# Altium project PE2.PrjPcb
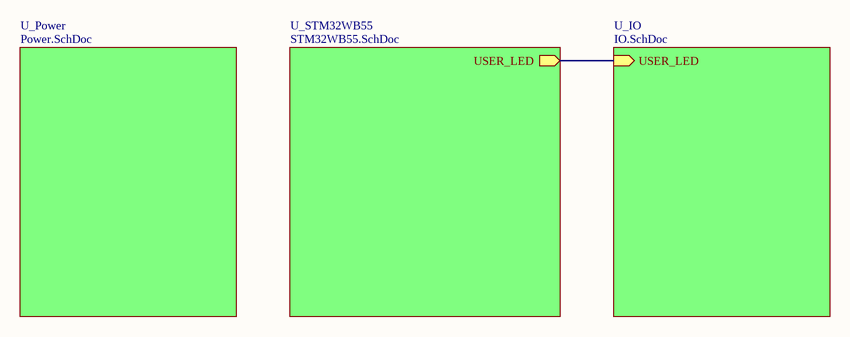
[diagram p0: TOP.SchDoc]
4 sheets, 98 parts. Net scope: hierarchical (ports join the sheet entries above them; power ports are global).
Board files: PCB.PcbDoc, PCB_Panel.PcbDoc, HalfPCB1.PcbDoc, HalfPCB2.PcbDoc
Sheets:
  TOP.SchDoc
    U_IO = IO.SchDoc
    U_Power = Power.SchDoc
    U_STM32WB55 = STM32WB55.SchDoc

## Sheet TOP.SchDoc: HB+SPO2 | Top
size A4; DocumentNumber: 1; Revision: 1b; SheetNumber: 1; SheetTotal: 4

### Sub-sheets
U_IO = IO.SchDoc: USER_LED (in)
U_Power = Power.SchDoc: no entries
U_STM32WB55 = STM32WB55.SchDoc: USER_LED (out)

### Nets
NetD4_1: sheet U_IO/USER_LED, sheet U_STM32WB55/USER_LED

### Notes on the sheet
- Title
- Size:
- Date:
- A4
- Number:
- Time:
- Revision:
- Sheet
- of
- ShareFox
- File:

## Sheet IO.SchDoc: HB+SPO2 | IO
size A4; DocumentNumber: 4; Revision: 2; SheetNumber: 4; SheetTotal: 4
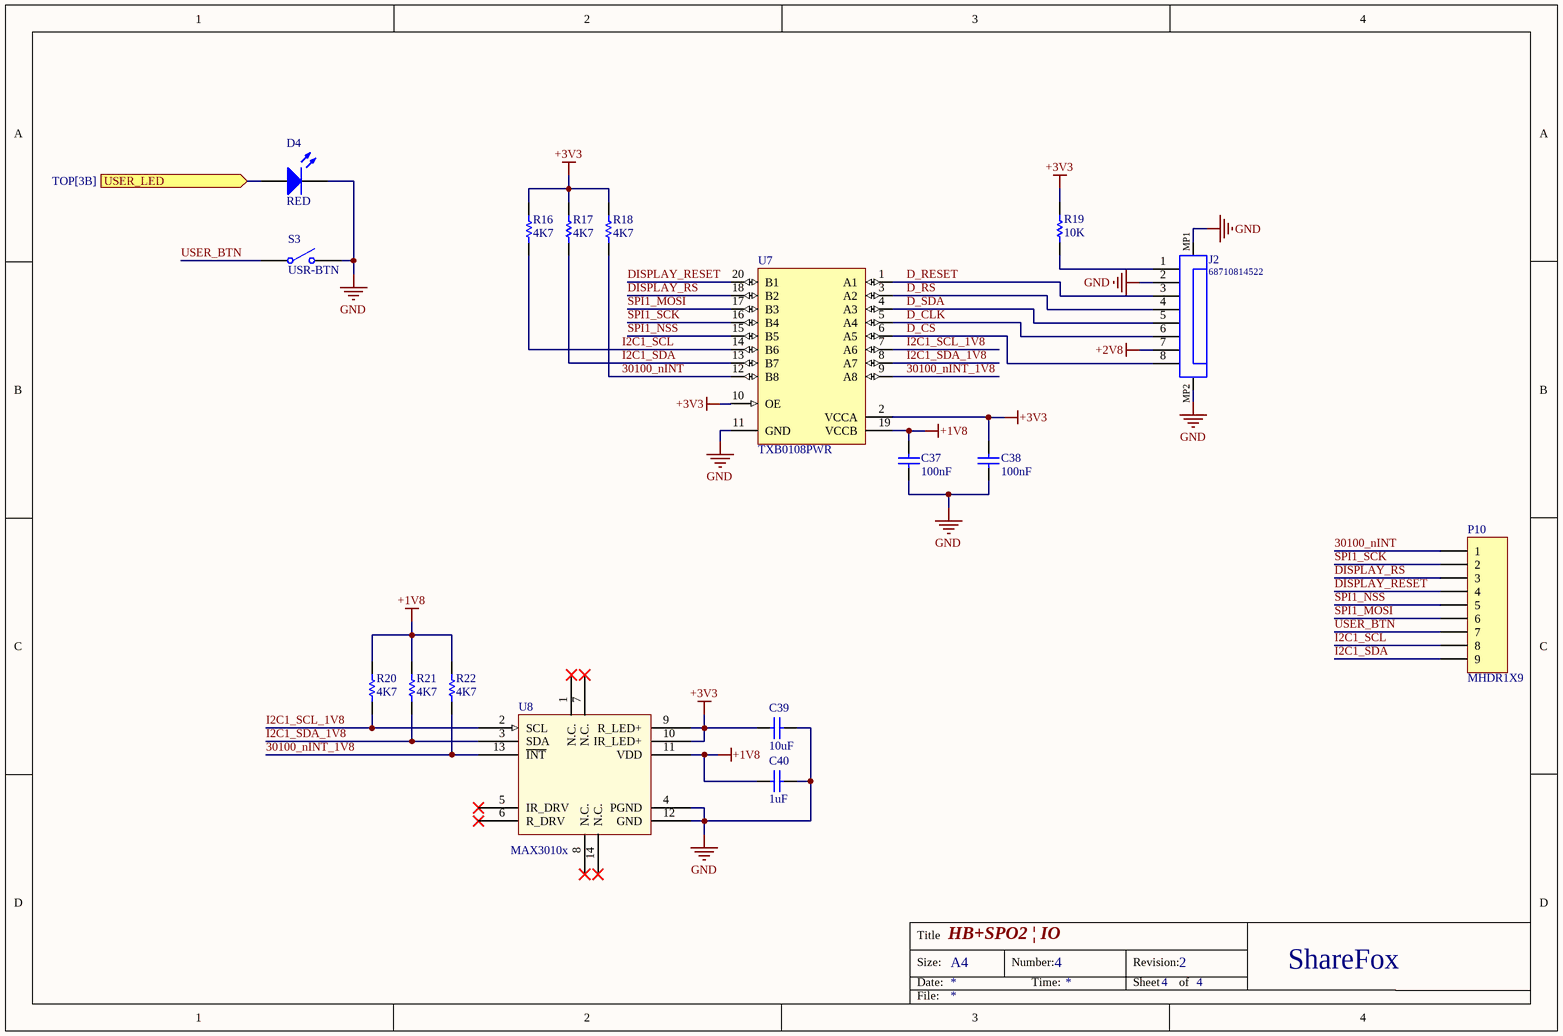
[diagram p1: IO.SchDoc]

### Parts
C37  100nF  [C_0603]
C38  100nF  [C_0603]
C39  10uF  [C_0805]
C40  1uF  [C_0603]
D4  RED  [D-0603]
J2  68710814522  [68710814522]
P10  MHDR1X9  [MHDR1X9]
R16  4K7  [C_0603]
R17  4K7  [C_0603]
R18  4K7  [C_0603]
R19  10K  [C_0603]
R20  4K7  [C_0603]
R21  4K7  [C_0603]
R22  4K7  [C_0603]
S3  USR-BTN  [HDR1X2]
U7  TXB0108PWR  [PW0020A_L]
U8  MAX3010x  [OESIP14R560x330]

### Ports
USER_LED (in, see TOP[3B])

### Nets
+1V8: C37.2 C40.2 R20.2 R21.2 R22.2 U7.19(VCCB) U8.11(VDD)
+2V8: J2.7
+3V3: C38.2 C39.2 R16.2 R17.2 R18.2 R19.1 U7.2(VCCA) U7.10(OE) U8.9(R_LED+) U8.10(IR_LED+)
GND: C37.1 C38.1 C39.1 C40.1 D4.2(K) J2.2 J2.MP1 J2.MP2 S3.2(NO) U7.11(GND) U8.4(PGND) U8.12(GND)
30100_nINT: P10.1 R18.1 U7.12(B8)
30100_nINT_1V8: R22.1 U7.9(A8) U8.13(~{INT})
D_CLK: J2.6 U7.5(A4)
D_CS: J2.8 U7.6(A5)
D_RESET: J2.3 U7.1(A1)
D_RS: J2.4 U7.3(A2)
D_SDA: J2.5 U7.4(A3)
DISPLAY_RESET: P10.4 U7.20(B1)
DISPLAY_RS: P10.3 U7.18(B2)
I2C1_SCL: P10.8 R16.1 U7.14(B6)
I2C1_SCL_1V8: R20.1 U7.7(A6) U8.2(SCL)
I2C1_SDA: P10.9 R17.1 U7.13(B7)
I2C1_SDA_1V8: R21.1 U7.8(A7) U8.3(SDA)
SPI1_MOSI: P10.6 U7.17(B3)
SPI1_NSS: P10.5 U7.15(B5)
SPI1_SCK: P10.2 U7.16(B4)
USER_BTN: P10.7 S3.1(COMMON)
NetD4_1: D4.1(A) ; port USER_LED
NetJ2_1: J2.1 R19.2

Not connected (* = marked no-connect by the designer): U8 1(N.C.)* 5(IR_DRV)* 6(R_DRV)* 7(N.C.)* 8(N.C.)* 14(N.C.)*

### Notes on the sheet
- Title
- Size:
- Date:
- A4
- Number:
- Time:
- Revision:
- Sheet
- of
- ShareFox
- File:

### Library data of the parts
C37-C40 = Cap: Capacitor; Published: 8-Jun-2000; LatestRevisionDate: 17-Jul-2002; LatestRevisionNote: Re-released for DXP Platform.; PackageReference: RAD-0.3; Publisher: Altium Limited; PackageDescription: Radial Cap, Thru-Hole; 2 Leads; 0.3 in Pin Spacing
  C37 C38: Value: 100nF
  C39: Value: 10uF
  C40: Value: 1uF
D4 = LED2: Typical RED, GREEN, YELLOW, AMBER GaAs LED; Published: 8-Jun-2000; LatestRevisionDate: 17-Jul-2002; LatestRevisionNote: Re-released for DXP Platform.; PackageVersion: Feb-2002; PackageReference: 3.2X1.6X1.1; Publisher: Altium Limited; PackageDescription: SM LED; 2 Flat Leads
J2 = CMP-1502-01528-1: SMT ZIF Connectors WR-FPC, Horizontal, Bottom Contact, pitch 0.5 mm, 8 pins; Manufacturer: Wurth Elektronik; Contact Resistance: 20mOhm; Pitch: 0.5mm; Withstanding Voltage: 250VAC; Working Voltage: 50VAC; Pin Number: 8; Rated Current: 0.5A; Contact Design: BottomContact; Publisher: WurthElektronik; Orientation: Horizontal; Manufacturer URL: http://www.we-online.de; Part Number: 68710814522; Mounting Technology: SMT; Packaging: TapeandReel; Package Reference: 68710814522; Operating Temperature: -25to85degC; Datasheet URL: https://katalog.we-online.de/em/datasheet/68710814522.pdf
P10 = MHDR1X9: Header, 9-Pin; LatestRevisionDate: 17-Jul-2002; LatestRevisionNote: Re-released for DXP Platform.; Publisher: Altium Limited
R16-R22 = Res1: Resistor; Published: 8-Jun-2000; LatestRevisionDate: 17-Jul-2002; LatestRevisionNote: Re-released for DXP Platform.; PackageReference: AXIAL-0.3; Publisher: Altium Limited; PackageDescription: Axial Device, Thru-Hole; 2 Leads; 0.3 in Pin Spacing
  R16-R18 R20-R22: Value: 4K7
  R19: Value: 10K
S3 = SW-SPST: Single-Pole, Single-Throw Switch; Published: 24-Mar-1999; LatestRevisionDate: 17-Jul-2002; LatestRevisionNote: Re-released for DXP Platform.; PackageReference: SPST-2; Publisher: Altium Limited; PackageDescription: Switch; 2 Leads
U7 = CMP-2000-07337-1: TXB0108 8-Bit Bidirectional Voltage-Level Translator with Auto-Direction Sensing and / +/- 15-kV ESD Protection, 1.2 to 3.6 V, -40 to 85 degC, 20-Pin TSSOP (PW), Green (RoHS & no Sb/Br), Tape and Reel; Manufacturer: Texas Instruments; Propagation Delay (Max): 4ns; Logic Function: Translator,Bidirectional; Input Type: Logic; Package Version: 4040064-5/G, 02/2011; Voltage - Supply: 1.2V~3.6V,1.65V~5.5V; Data Rate: 100Mbps; Other Names: 296-21527-6; Number of Channels: 8; Differential - Input: Output:No/No; Number of Outputs/Channel: 1; Product Training Modules: VoltageLevelTranslation; Dynamic Catalog: TXBSeries; Package Reference: PW20; Package Description: 20-Pin Small Outline Package Integrated Circuit, Body 6.5 x 4.4 mm, Pitch 0.65 mm; Category: IntegratedCircuits(ICs); Datasheet URL: http://www.ti.com/general/docs/lit/getliterature.tsp?genericPartNumber=TXB0108&fileType=pdf; Package / Case: 20-TSSOP(0.173",4.40mmWidth); Family: Logic-Translators; Standard Package: 1; Series: -; Manufacturer URL: http://www.ti.com/; Number of Bits: 8; Package URL: http://www.ti.com/litv/pdf/mpds362; Output Type: Logic; Datasheet Version: Rev. F, 12/2014; Packaging: Digi-Reel®; Operating Temperature: -40°C~85°C; Supplier Device Package: 20-TSSOP; Mounting Technology: SurfaceMount
U8 = MAX3010x: Pulse Oximeter and Heart-Rate Sensor IC  for Wearable Health

## Sheet Power.SchDoc: HB+SPO2 | Power
size A4; DocumentNumber: 2; Revision: 2; SheetNumber: 2; SheetTotal: 4
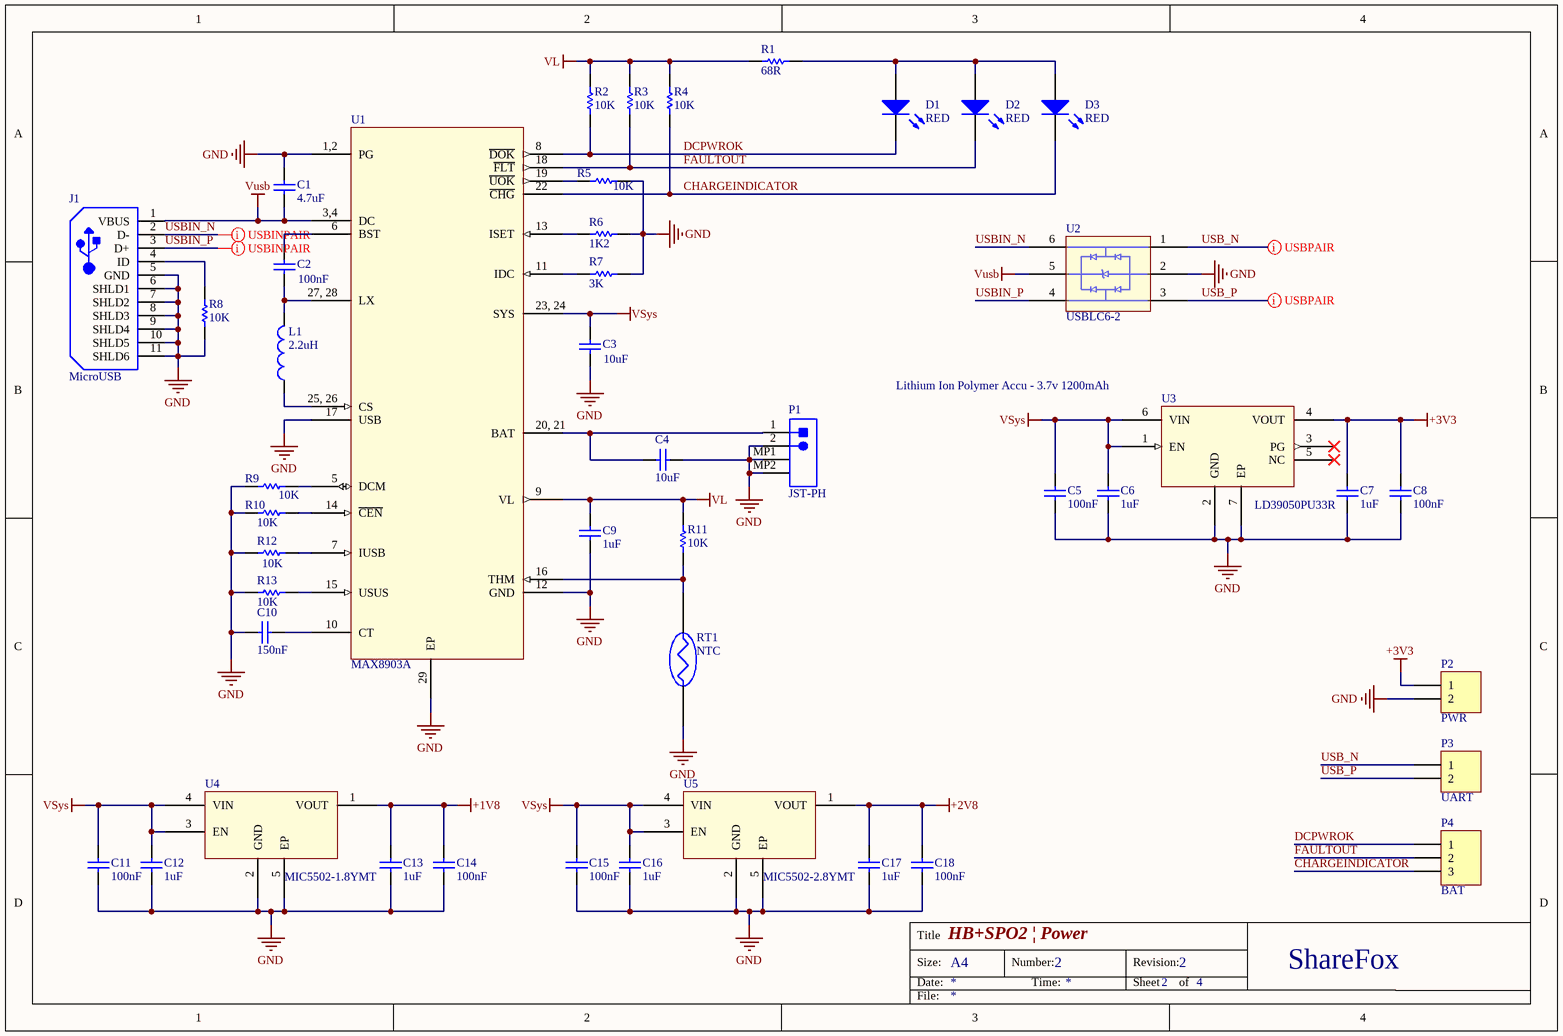
[diagram p2: Power.SchDoc]

### Parts
C1  4.7uF  [C_1206]
C2  100nF  [C_0603]
C3  10uF  [C_0805]
C4  10uF  [C_0805]
C5  100nF  [C_0603]
C6  1uF  [C_0603]
C7  1uF  [C_0603]
C8  100nF  [C_0603]
C9  1uF  [C_0603]
C10  150nF  [C_0603]
C11  100nF  [C_0603]
C12  1uF  [C_0603]
C13  1uF  [C_0603]
C14  100nF  [C_0603]
C15  100nF  [C_0603]
C16  1uF  [C_0603]
C17  1uF  [C_0603]
C18  100nF  [C_0603]
D1  RED  [D-0603]
D2  RED  [D-0603]
D3  RED  [D-0603]
J1  MicroUSB  [FCI-10118194-0001LF-5_V]
L1  2.2uH  [L-1008]
P1  JST-PH  [JST- S2B-PH-SM4-TB(LF)(SN)-2_V]
P2  PWR  [MHDR1X2]
P3  UART  [MHDR1X2]
P4  BAT  [MHDR1X3]
R1  68R  [C_0603]
R2  10K  [C_0603]
R3  10K  [C_0603]
R4  10K  [C_0603]
R5  10K  [C_0603]
R6  1K2  [C_0603]
R7  3K  [C_0603]
R8  10K  [C_0603]
R9  10K  [C_0603]
R10  10K  [C_0603]
R11  10K  [C_0603]
R12  10K  [C_0603]
R13  10K  [C_0603]
RT1  NTC  [HDR1X2]
U1  MAX8903A  [QFN28P40S400X400EP260x260]
U2  USBLC6-2  [SOT23-6P95R280X90]
U3  LD39050PU33R  [SON6P95S300X300EP237x149]
U4  MIC5502-1.8YMT  [DFN4P65S100x100EP48x48]
U5  MIC5502-2.8YMT  [DFN4P65S100x100EP48x48]

### Nets
+1V8: C13.1 C14.1 U4.1(VOUT)
+2V8: C17.1 C18.1 U5.1(VOUT)
+3V3: C7.1 C8.1 P2.1 U3.4(VOUT)
GND: C1.1 C3.1 C4.1 C5.2 C6.2 C7.2 C8.2 C9.2 C10.1 C11.2 C12.2 C13.2 C14.2 C15.2 C16.2 C17.2 C18.2 J1.5(GND) J1.6(SHLD1) J1.7(SHLD2) J1.8(SHLD3) J1.9(SHLD4) J1.10(SHLD5) J1.11(SHLD6) P1.2 P1.MP1 P1.MP2 P2.2 R5.1 R6.1 R7.1 R8.2 R9.2 R10.2 R12.2 R13.2 RT1.1 U1.1,2(PG) U1.12(GND) U1.17(USB) U1.29(EP) U2.2 U3.2(GND) U3.7(EP) U4.2(GND) U4.5(EP) U5.2(GND) U5.5(EP)
VL: C9.1 R1.2 R2.2 R3.2 R4.2 R11.1 U1.9(VL)
VSys: C3.2 C5.1 C6.1 C11.1 C12.1 C15.1 C16.1 U1.23,_24(SYS) U3.1(EN) U3.6(VIN) U4.3(EN) U4.4(VIN) U5.3(EN) U5.4(VIN)
Vusb: C1.2 J1.1(VBUS) U1.3,4(DC) U2.5
CHARGEINDICATOR: D3.2(K) P4.3 R4.1 U1.22(~{CHG})
DCPWROK: D1.2(K) P4.1 R2.1 U1.8(~{DOK})
FAULTOUT: D2.2(K) P4.2 R3.1 U1.18(~{FLT})
USB_N: P3.1 U2.1
USB_P: P3.2 U2.3
USBIN_N: J1.2(D-) U2.6
USBIN_P: J1.3(D+) U2.4
NetC2_1: C2.1 L1.2 U1.27,_28(LX)
NetC2_2: C2.2 U1.6(BST)
NetC4_2: C4.2 P1.1 U1.20,_21(BAT)
NetC10_2: C10.2 U1.10(CT)
NetD1_1: D1.1(A) D2.1(A) D3.1(A) R1.1
NetJ1_4: J1.4(ID) R8.1
NetL1_1: L1.1 U1.25,_26(CS)
NetR5_2: R5.2 U1.19(~{UOK})
NetR6_2: R6.2 U1.13(ISET)
NetR7_2: R7.2 U1.11(IDC)
NetR9_1: R9.1 U1.5(DCM)
NetR10_1: R10.1 U1.14(~{CEN})
NetR11_2: R11.2 RT1.2 U1.16(THM)
NetR12_1: R12.1 U1.7(IUSB)
NetR13_1: R13.1 U1.15(USUS)

Not connected (* = marked no-connect by the designer): U3 3(PG)* 5(NC)*

### Layout directives
differential pair: USB_N, USB_P, USBIN_N, USBIN_P

### Notes on the sheet
- (near P1) Lithium Ion Polymer Accu - 3.7v 1200mAh
- Title
- Size:
- Date:
- A4
- Number:
- Time:
- Revision:
- Sheet
- of
- ShareFox
- File:

### Library data of the parts
C1-C18 = Cap: Capacitor; Published: 8-Jun-2000; LatestRevisionDate: 17-Jul-2002; LatestRevisionNote: Re-released for DXP Platform.; PackageReference: RAD-0.3; Publisher: Altium Limited; PackageDescription: Radial Cap, Thru-Hole; 2 Leads; 0.3 in Pin Spacing
  C1: Value: 4.7uF
  C2 C5 C8 C11 C14 C15 C18: Value: 100nF
  C3 C4: Value: 10uF
  C6 C7 C9 C12 C13 C16 C17: Value: 1uF
  C10: Value: 150nF
D1-D3 = LED2: as D4 on sheet IO; Published: 8-Jun-2000; LatestRevisionDate: 17-Jul-2002; LatestRevisionNote: Re-released for DXP Platform.; PackageVersion: Feb-2002; PackageReference: 3.2X1.6X1.1; Publisher: Altium Limited; PackageDescription: SM LED; 2 Flat Leads
J1 = CMP-2000-05120-1: Micro USB B Type Receptacle, 1.8 A, -55 to 85 degC, 5-Pin SMD, RoHS, Tape and Reel; Manufacturer: Amphenol FCI; Body Orientation: RightAngle; Number of Contacts: 5; Pitch: 0.65mm; Gender: RCP; Rad Hard: No; Package Reference: 10118194-0001LF-5; Mounting: SurfaceMount; Manufacturer URL: http://www.fci.com/; Packaging: CutTape; Datasheet URL: https://datasheet.ciiva.com/26945/getdatasheetpartid-418619-26945695.pdf; Termination Method: Solder; Package Description: 5-Pin Surface Mount Device, Body 8.05 x 5.53 mm, Pitch 0.65 mm; Type: MicroUSBTypeB; Datasheet Version: Rev. A, 10/2011
L1 = Inductor: Code_IEC: 1005; Published: 8-Jun-2000; LatestRevisionDate: 29-May-2009; LatestRevisionNote: IPC-7351 Footprint Added.; PackageReference: 0402-A; Publisher: Altium Limited; PackageDescription: Chip Inductor; Code_JEITA: 0402; Value: 2.2uH
P1 = CMP-1755-00001-1: Male Header, Pitch 2 mm, 1 x 2 Position, Height 5.5 mm, -25 to 85 degC, RoHS, Tape and Reel; Current Rating: 3 A; ComponentLink1URL: http://www.jst.com/home2.html; Radiation Hardening: No; RoHSCompliant: True; Mount: Through Hole; Contact Material: Bronze; Package Quantity: 100; Width: 2.34 mm; DatasheetVersion: Dec-12; Height: 8.13 mm; Max Operating Temperature: 105degC; ComponentLink2Description: Datasheet; Lead Pitch: 0.1 inch; Contact Finish: Lead; Packaging: Bulk; Colour: Black; Contact Plating: Tin; Min Operating Temperature: -65degC; ComponentLink1Description: Manufacturer URL; PackageReference: S2B-PH-SM4-TB(LF)(SN)-2; PackageDescription: Male Header, Pitch 2 mm, 1 x 2 Position, Height 5.5 mm; ComponentLink2URL: http://www.jst-mfg.com/product/pdf/eng/ePH.pdf; Pins: 40; Length: 101.19 mm
P2 P3 = MHDR1X2: Header, 2-Pin; LatestRevisionDate: 17-Jul-2002; LatestRevisionNote: Re-released for DXP Platform.; Publisher: Altium Limited
P4 = MHDR1X3: Header, 3-Pin; LatestRevisionDate: 17-Jul-2002; LatestRevisionNote: Re-released for DXP Platform.; Publisher: Altium Limited
R1-R13 = Res1: Resistor; Published: 8-Jun-2000; LatestRevisionDate: 17-Jul-2002; LatestRevisionNote: Re-released for DXP Platform.; PackageReference: AXIAL-0.3; Publisher: Altium Limited; PackageDescription: Axial Device, Thru-Hole; 2 Leads; 0.3 in Pin Spacing
  R1: Value: 68R
  R2-R5 R8-R13: Value: 10K
  R6: Value: 1K2
  R7: Value: 3K
RT1 = NTC/PTC: 2322-640-63103
U1 = MAX8903A: 2A 1-Cell Li+ DC-DC Chargersfor USB and Adapter Power
U2 = USBLC6-2: Very low capacitance ESD protection
U3 = LD39050PUxxR: 500 mA low quiescent current and low noise voltage regulator
U4 U5 = MIC550x-x.xYMT: Single 300mA LDO

## Sheet STM32WB55.SchDoc: HB+SPO2 | STM
size A4; DocumentNumber: 3; Revision: 2; SheetNumber: 3; SheetTotal: 4
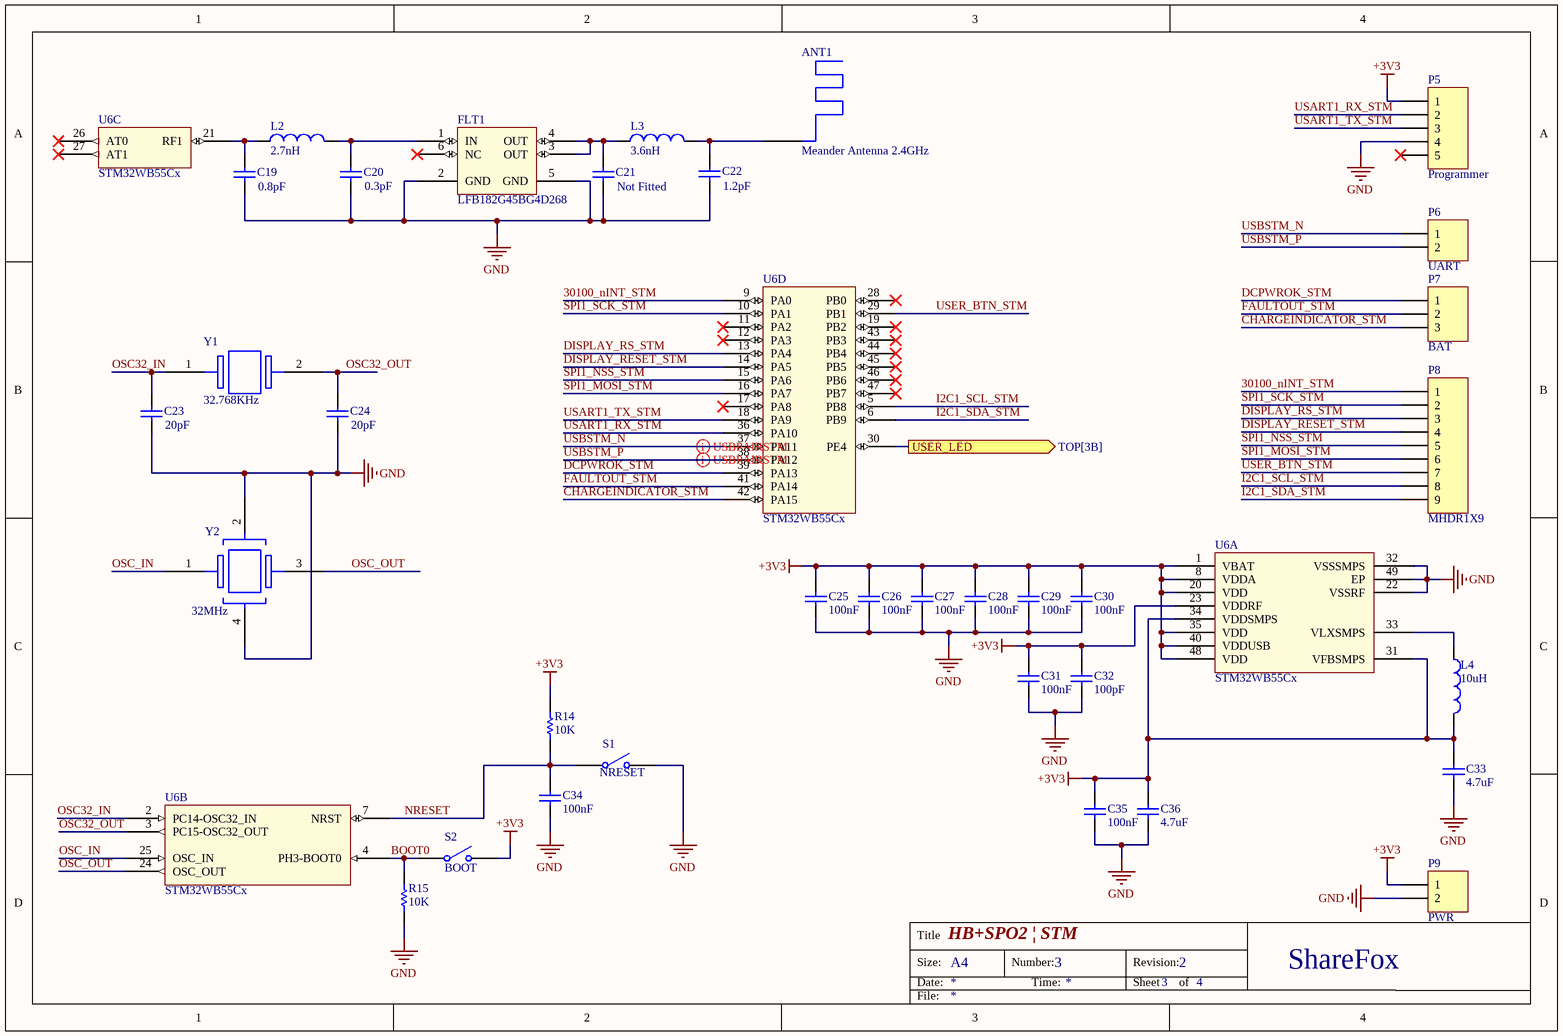
[diagram p3: STM32WB55.SchDoc]

### Parts
ANT1  Meander Antenna 2.4GHz  [Meander2.4G]
C19  0.8pF  [C_0603]
C20  0.3pF  [C_0603]
C21  Not Fitted  [C_0603]
C22  1.2pF  [C_0603]
C23  20pF  [C_0603]
C24  20pF  [C_0603]
C25  100nF  [C_0603]
C26  100nF  [C_0603]
C27  100nF  [C_0603]
C28  100nF  [C_0603]
C29  100nF  [C_0603]
C30  100nF  [C_0603]
C31  100nF  [C_0603]
C32  100pF  [C_0603]
C33  4.7uF  [C_1206]
C34  100nF  [C_0603]
C35  100nF  [C_0603]
C36  4.7uF  [C_1206]
FLT1  LFB182G45BG4D268  [LFB182G45BG4D268]
L2  2.7nH  [L-0603]
L3  3.6nH  [L-0603]
L4  10uH  [L-0603]
P5  Programmer  [HDR1X5]
P6  UART  [MHDR1X2]
P7  BAT  [MHDR1X3]
P8  MHDR1X9  [MHDR1X9]
P9  PWR  [MHDR1X2]
R14  10K  [C_0603]
R15  10K  [C_0603]
S1  NRESET  [B3U-1000P-B]
S2  BOOT  [B3U-1000P-B]
U6  STM32WB55Cx  [QFN48P50S700x700EP560x560]  (parts A,B,C,D of 4)
Y1  32.768KHz  [ECX-31B]
Y2  32MHz  [Y_3225]

### Ports
USER_LED (out, see TOP[3B])

### Nets
+3V3: C25.2 C26.2 C27.2 C28.2 C29.2 C30.2 C31.2 C32.2 C33.2 C35.2 C36.2 L4.2 P5.1 P9.1 R14.1 S2.2(NO) U6.1(VBAT) U6.8(VDDA) U6.20(VDD) U6.23(VDDRF) U6.31(VFBSMPS) U6.34(VDDSMPS) U6.35(VDD) U6.40(VDDUSB) U6.48(VDD)
GND: C19.1 C20.1 C21.1 C22.1 C23.1 C24.1 C25.1 C26.1 C27.1 C28.1 C29.1 C30.1 C31.1 C32.1 C33.1 C34.2 C35.1 C36.1 FLT1.2(GND) FLT1.5(GND) P5.4 P9.2 R15.1 S1.2(NO) U6.22(VSSRF) U6.32(VSSSMPS) U6.49(EP) Y2.2 Y2.4
30100_nINT_STM: P8.1 U6.9(PA0)
BOOT0: R15.2 S2.1(COMMON) U6.4(PH3-BOOT0)
CHARGEINDICATOR_STM: P7.3 U6.42(PA15)
DCPWROK_STM: P7.1 U6.39(PA13)
DISPLAY_RESET_STM: P8.4 U6.14(PA5)
DISPLAY_RS_STM: P8.3 U6.13(PA4)
FAULTOUT_STM: P7.2 U6.41(PA14)
I2C1_SCL_STM: P8.8 U6.5(PB8)
I2C1_SDA_STM: P8.9 U6.6(PB9)
NRESET: C34.1 R14.2 S1.1(COMMON) U6.7(NRST)
OSC32_IN: C23.2 U6.2(PC14-OSC32_IN) Y1.1
OSC32_OUT: C24.2 U6.3(PC15-OSC32_OUT) Y1.2
OSC_IN: U6.25(OSC_IN) Y2.1
OSC_OUT: U6.24(OSC_OUT) Y2.3
SPI1_MOSI_STM: P8.6 U6.16(PA7)
SPI1_NSS_STM: P8.5 U6.15(PA6)
SPI1_SCK_STM: P8.2 U6.10(PA1)
USART1_RX_STM: P5.2 U6.36(PA10)
USART1_TX_STM: P5.3 U6.18(PA9)
USBSTM_N: P6.1 U6.37(PA11)
USBSTM_P: P6.2 U6.38(PA12)
USER_BTN_STM: P8.7 U6.29(PB1)
NetANT1_1: ANT1.1 C22.2 L3.2
NetC19_2: C19.2 L2.1 U6.21(RF1)
NetC20_2: C20.2 FLT1.1(IN) L2.2
NetC21_2: C21.2 FLT1.3(OUT) FLT1.4(OUT) L3.1
NetD4_1: U6.30(PE4) ; port USER_LED
NetL4_1: L4.1 U6.33(VLXSMPS)

Not connected (* = marked no-connect by the designer): FLT1 6(NC)*; P5 5*; U6 11(PA2)* 12(PA3)* 17(PA8)* 19(PB2)* 26(AT0)* 27(AT1)* 28(PB0)* 43(PB3)* 44(PB4)* 45(PB5)* 46(PB6)* 47(PB7)*

### Layout directives
differential pair: USBSTM_N, USBSTM_P

### Notes on the sheet
- Title
- Size:
- Date:
- A4
- Number:
- Time:
- Revision:
- Sheet
- of
- ShareFox
- File:

### Library data of the parts
ANT1 = Meander Antenna 2.4GHz: PCB TRACE / DONT TRY TO LOOK FOR PARTS
C19-C36 = Cap: Capacitor; Published: 8-Jun-2000; LatestRevisionDate: 17-Jul-2002; LatestRevisionNote: Re-released for DXP Platform.; PackageReference: RAD-0.3; Publisher: Altium Limited; PackageDescription: Radial Cap, Thru-Hole; 2 Leads; 0.3 in Pin Spacing
  C19: Value: 0.8pF
  C20: Value: 0.3pF
  C21: Value: Not Fitted
  C22: Value: 1.2pF
  C23 C24: Value: 20pF
  C25-C31 C34 C35: Value: 100nF
  C32: Value: 100pF
  C33 C36: Value: 4.7uF
FLT1 = LFB182G45BG4D268: Ultra-small, low-profiled, lightweight band-pass filters.
L2-L4 = Inductor: Code_IEC: 1005; Published: 8-Jun-2000; LatestRevisionDate: 29-May-2009; LatestRevisionNote: IPC-7351 Footprint Added.; PackageReference: 0402-A; Publisher: Altium Limited; PackageDescription: Chip Inductor; Code_JEITA: 0402
  L2: Value: 2.7nH
  L3: Value: 3.6nH
  L4: Value: 10uH
P5 = MHDR1X5: Header, 5-Pin; LatestRevisionDate: 17-Jul-2002; LatestRevisionNote: Re-released for DXP Platform.; Publisher: Altium Limited
P6 P9 = MHDR1X2: Header, 2-Pin; LatestRevisionDate: 17-Jul-2002; LatestRevisionNote: Re-released for DXP Platform.; Publisher: Altium Limited
P7 = MHDR1X3: Header, 3-Pin; LatestRevisionDate: 17-Jul-2002; LatestRevisionNote: Re-released for DXP Platform.; Publisher: Altium Limited
P8 = MHDR1X9: Header, 9-Pin; LatestRevisionDate: 17-Jul-2002; LatestRevisionNote: Re-released for DXP Platform.; Publisher: Altium Limited
R14 R15 = Res1: Resistor; Published: 8-Jun-2000; LatestRevisionDate: 17-Jul-2002; LatestRevisionNote: Re-released for DXP Platform.; PackageReference: AXIAL-0.3; Publisher: Altium Limited; PackageDescription: Axial Device, Thru-Hole; 2 Leads; 0.3 in Pin Spacing; Value: 10K
S1 S2 = SW-SPST: Single-Pole, Single-Throw Switch; Published: 24-Mar-1999; LatestRevisionDate: 17-Jul-2002; LatestRevisionNote: Re-released for DXP Platform.; PackageReference: SPST-2; Publisher: Altium Limited; PackageDescription: Switch; 2 Leads
U6 = STM32WB55Cx: Multiprotocol wireless 32-bit MCU Arm®-based Cortex®-M4 with FPU, Bluetooth® 5 and 802.15.4 radio solution
Y1 = XTAL 3215
Y2 = XTAL 3225 2_4GND

## Nets that join several sheets
+1V8: IO (7 pins), Power (C13.1 C14.1 U4.1)
+2V8: IO (J2.7), Power (C17.1 C18.1 U5.1)
+3V3: IO (10 pins), Power (C7.1 C8.1 P2.1 U3.4), STM32WB55 (25 pins)
GND: IO (12 pins), Power (48 pins), STM32WB55 (29 pins)
NetD4_1: IO (D4.1), STM32WB55 (U6.30)